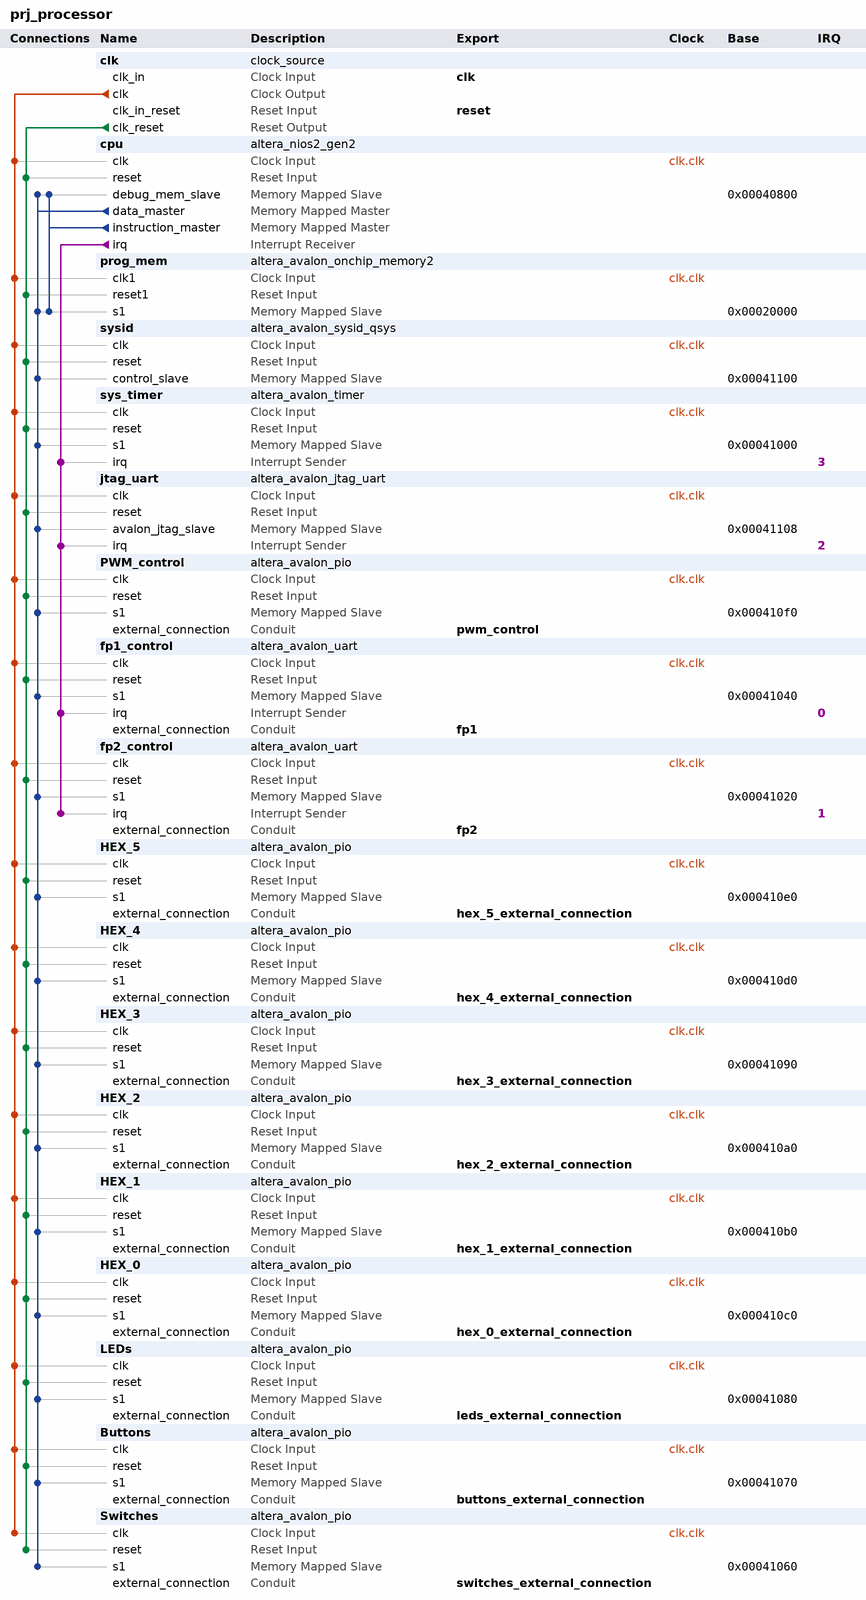
[diagram p0: system contents]
# Platform Designer (Qsys) system prj_processor, MAX 10 10M50DAF484C7G
# Parameters at their usual value, and those the tool derives, are not listed.
package require -exact qsys 16.1
create_system prj_processor
set_project_property DEVICE_FAMILY {MAX 10}
set_project_property DEVICE 10M50DAF484C7G

add_instance clk clock_source 16.1
set_instance_parameter_value clk clockFrequency 50000000

add_instance cpu altera_nios2_gen2 16.1
set_instance_parameter_value cpu dcache_size 2048
set_instance_parameter_value cpu exceptionSlave prog_mem.s1
set_instance_parameter_value cpu icache_size 512
set_instance_parameter_value cpu impl Fast
set_instance_parameter_value cpu resetSlave prog_mem.s1

add_instance prog_mem altera_avalon_onchip_memory2 16.1
set_instance_parameter_value prog_mem dataWidth 32
set_instance_parameter_value prog_mem dualPort false
set_instance_parameter_value prog_mem initMemContent false
set_instance_parameter_value prog_mem initializationFileName onchip_mem.hex
set_instance_parameter_value prog_mem memorySize 80000

add_instance sysid altera_avalon_sysid_qsys 16.1
set_instance_parameter_value sysid id -749882561

add_instance sys_timer altera_avalon_timer 16.1
set_instance_parameter_value sys_timer period 1
set_instance_parameter_value sys_timer periodUnits MSEC

add_instance jtag_uart altera_avalon_jtag_uart 16.1
set_instance_parameter_value jtag_uart simInteractiveOptions NO_INTERACTIVE_WINDOWS

add_instance PWM_control altera_avalon_pio 16.1
set_instance_parameter_value PWM_control direction Output
set_instance_parameter_value PWM_control width 8

add_instance fp1_control altera_avalon_uart 16.1
set_instance_parameter_value fp1_control baud 57600
set_instance_parameter_value fp1_control dataBits 8
set_instance_parameter_value fp1_control fixedBaud true
set_instance_parameter_value fp1_control parity NONE
set_instance_parameter_value fp1_control stopBits 2

add_instance fp2_control altera_avalon_uart 16.1
set_instance_parameter_value fp2_control baud 57600
set_instance_parameter_value fp2_control dataBits 8
set_instance_parameter_value fp2_control fixedBaud true
set_instance_parameter_value fp2_control parity NONE
set_instance_parameter_value fp2_control stopBits 2

add_instance HEX_5 altera_avalon_pio 16.1
set_instance_parameter_value HEX_5 direction Output
set_instance_parameter_value HEX_5 width 8

add_instance HEX_4 altera_avalon_pio 16.1
set_instance_parameter_value HEX_4 direction Output
set_instance_parameter_value HEX_4 width 8

add_instance HEX_3 altera_avalon_pio 16.1
set_instance_parameter_value HEX_3 direction Output
set_instance_parameter_value HEX_3 width 8

add_instance HEX_2 altera_avalon_pio 16.1
set_instance_parameter_value HEX_2 direction Output
set_instance_parameter_value HEX_2 width 8

add_instance HEX_1 altera_avalon_pio 16.1
set_instance_parameter_value HEX_1 direction Output
set_instance_parameter_value HEX_1 width 8

add_instance HEX_0 altera_avalon_pio 16.1
set_instance_parameter_value HEX_0 direction Output
set_instance_parameter_value HEX_0 width 8

add_instance LEDs altera_avalon_pio 16.1
set_instance_parameter_value LEDs direction Output
set_instance_parameter_value LEDs width 10

add_instance Buttons altera_avalon_pio 16.1
set_instance_parameter_value Buttons direction Input
set_instance_parameter_value Buttons width 2

add_instance Switches altera_avalon_pio 16.1
set_instance_parameter_value Switches direction Input
set_instance_parameter_value Switches width 9

# connections
add_connection clk.clk Buttons.clk clock
add_connection clk.clk cpu.clk clock
add_connection clk.clk fp1_control.clk clock
add_connection clk.clk fp2_control.clk clock
add_connection clk.clk HEX_0.clk clock
add_connection clk.clk HEX_1.clk clock
add_connection clk.clk HEX_2.clk clock
add_connection clk.clk HEX_3.clk clock
add_connection clk.clk HEX_4.clk clock
add_connection clk.clk HEX_5.clk clock
add_connection clk.clk jtag_uart.clk clock
add_connection clk.clk LEDs.clk clock
add_connection clk.clk prog_mem.clk1 clock
add_connection clk.clk PWM_control.clk clock
add_connection clk.clk Switches.clk clock
add_connection clk.clk sys_timer.clk clock
add_connection clk.clk sysid.clk clock
add_connection clk.clk_reset Buttons.reset reset
add_connection clk.clk_reset cpu.reset reset
add_connection clk.clk_reset fp1_control.reset reset
add_connection clk.clk_reset fp2_control.reset reset
add_connection clk.clk_reset HEX_0.reset reset
add_connection clk.clk_reset HEX_1.reset reset
add_connection clk.clk_reset HEX_2.reset reset
add_connection clk.clk_reset HEX_3.reset reset
add_connection clk.clk_reset HEX_4.reset reset
add_connection clk.clk_reset HEX_5.reset reset
add_connection clk.clk_reset jtag_uart.reset reset
add_connection clk.clk_reset LEDs.reset reset
add_connection clk.clk_reset prog_mem.reset1 reset
add_connection clk.clk_reset PWM_control.reset reset
add_connection clk.clk_reset Switches.reset reset
add_connection clk.clk_reset sys_timer.reset reset
add_connection clk.clk_reset sysid.reset reset
add_connection cpu.data_master Buttons.s1 avalon
set_connection_parameter_value cpu.data_master/Buttons.s1 baseAddress 0x00041070
add_connection cpu.data_master cpu.debug_mem_slave avalon
set_connection_parameter_value cpu.data_master/cpu.debug_mem_slave baseAddress 0x00040800
add_connection cpu.data_master fp1_control.s1 avalon
set_connection_parameter_value cpu.data_master/fp1_control.s1 baseAddress 0x00041040
add_connection cpu.data_master fp2_control.s1 avalon
set_connection_parameter_value cpu.data_master/fp2_control.s1 baseAddress 0x00041020
add_connection cpu.data_master HEX_0.s1 avalon
set_connection_parameter_value cpu.data_master/HEX_0.s1 baseAddress 0x000410c0
add_connection cpu.data_master HEX_1.s1 avalon
set_connection_parameter_value cpu.data_master/HEX_1.s1 baseAddress 0x000410b0
add_connection cpu.data_master HEX_2.s1 avalon
set_connection_parameter_value cpu.data_master/HEX_2.s1 baseAddress 0x000410a0
add_connection cpu.data_master HEX_3.s1 avalon
set_connection_parameter_value cpu.data_master/HEX_3.s1 baseAddress 0x00041090
add_connection cpu.data_master HEX_4.s1 avalon
set_connection_parameter_value cpu.data_master/HEX_4.s1 baseAddress 0x000410d0
add_connection cpu.data_master HEX_5.s1 avalon
set_connection_parameter_value cpu.data_master/HEX_5.s1 baseAddress 0x000410e0
add_connection cpu.data_master jtag_uart.avalon_jtag_slave avalon
set_connection_parameter_value cpu.data_master/jtag_uart.avalon_jtag_slave baseAddress 0x00041108
add_connection cpu.data_master LEDs.s1 avalon
set_connection_parameter_value cpu.data_master/LEDs.s1 baseAddress 0x00041080
add_connection cpu.data_master prog_mem.s1 avalon
set_connection_parameter_value cpu.data_master/prog_mem.s1 baseAddress 0x00020000
add_connection cpu.data_master PWM_control.s1 avalon
set_connection_parameter_value cpu.data_master/PWM_control.s1 baseAddress 0x000410f0
add_connection cpu.data_master Switches.s1 avalon
set_connection_parameter_value cpu.data_master/Switches.s1 baseAddress 0x00041060
add_connection cpu.data_master sys_timer.s1 avalon
set_connection_parameter_value cpu.data_master/sys_timer.s1 baseAddress 0x00041000
add_connection cpu.data_master sysid.control_slave avalon
set_connection_parameter_value cpu.data_master/sysid.control_slave baseAddress 0x00041100
add_connection cpu.instruction_master cpu.debug_mem_slave avalon
set_connection_parameter_value cpu.instruction_master/cpu.debug_mem_slave baseAddress 0x00040800
add_connection cpu.instruction_master prog_mem.s1 avalon
set_connection_parameter_value cpu.instruction_master/prog_mem.s1 baseAddress 0x00020000
add_connection cpu.irq fp1_control.irq interrupt
set_connection_parameter_value cpu.irq/fp1_control.irq irqNumber 0
add_connection cpu.irq fp2_control.irq interrupt
set_connection_parameter_value cpu.irq/fp2_control.irq irqNumber 1
add_connection cpu.irq jtag_uart.irq interrupt
set_connection_parameter_value cpu.irq/jtag_uart.irq irqNumber 2
add_connection cpu.irq sys_timer.irq interrupt
set_connection_parameter_value cpu.irq/sys_timer.irq irqNumber 3

# exported interfaces
add_interface buttons_external_connection conduit end
set_interface_property buttons_external_connection EXPORT_OF Buttons.external_connection
add_interface clk clock sink
set_interface_property clk EXPORT_OF clk.clk_in
add_interface fp1 conduit end
set_interface_property fp1 EXPORT_OF fp1_control.external_connection
add_interface fp2 conduit end
set_interface_property fp2 EXPORT_OF fp2_control.external_connection
add_interface hex_0_external_connection conduit end
set_interface_property hex_0_external_connection EXPORT_OF HEX_0.external_connection
add_interface hex_1_external_connection conduit end
set_interface_property hex_1_external_connection EXPORT_OF HEX_1.external_connection
add_interface hex_2_external_connection conduit end
set_interface_property hex_2_external_connection EXPORT_OF HEX_2.external_connection
add_interface hex_3_external_connection conduit end
set_interface_property hex_3_external_connection EXPORT_OF HEX_3.external_connection
add_interface hex_4_external_connection conduit end
set_interface_property hex_4_external_connection EXPORT_OF HEX_4.external_connection
add_interface hex_5_external_connection conduit end
set_interface_property hex_5_external_connection EXPORT_OF HEX_5.external_connection
add_interface leds_external_connection conduit end
set_interface_property leds_external_connection EXPORT_OF LEDs.external_connection
add_interface pwm_control conduit end
set_interface_property pwm_control EXPORT_OF PWM_control.external_connection
add_interface reset reset sink
set_interface_property reset EXPORT_OF clk.clk_in_reset
add_interface switches_external_connection conduit end
set_interface_property switches_external_connection EXPORT_OF Switches.external_connection

set_interconnect_requirement {$system} qsys_mm.clockCrossingAdapter HANDSHAKE
set_interconnect_requirement {$system} qsys_mm.enableEccProtection FALSE
set_interconnect_requirement {$system} qsys_mm.insertDefaultSlave FALSE
set_interconnect_requirement {$system} qsys_mm.maxAdditionalLatency 1

save_system prj_processor.qsys
